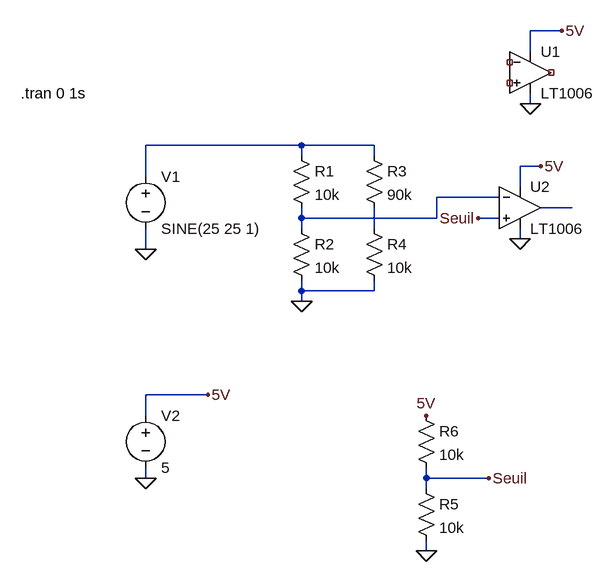
[diagram p0: schematic calibre_courant.asc]
calibre_courant.asc, the LTspice schematic file:
Version 4
SHEET 1 880 680
WIRE 752 -256 704 -256
WIRE 704 -224 704 -256
WIRE 704 -144 704 -160
WIRE 352 -80 112 -80
WIRE 464 -80 352 -80
WIRE 352 -64 352 -80
WIRE 464 -64 464 -80
WIRE 720 -48 688 -48
WIRE 112 -32 112 -80
WIRE 688 -16 688 -48
WIRE 656 0 560 0
WIRE 768 16 720 16
WIRE 352 32 352 16
WIRE 560 32 560 0
WIRE 560 32 352 32
WIRE 656 32 624 32
WIRE 352 48 352 32
WIRE 464 48 464 16
WIRE 688 64 688 48
WIRE 112 80 112 48
WIRE 352 144 352 128
WIRE 464 144 464 128
WIRE 464 144 352 144
WIRE 352 160 352 144
WIRE 208 304 112 304
WIRE 112 336 112 304
WIRE 112 432 112 416
WIRE 544 432 544 416
WIRE 640 432 544 432
WIRE 544 448 544 432
WIRE 544 544 544 528
FLAG 112 80 0
FLAG 352 160 0
FLAG 112 432 0
FLAG 208 304 5V
FLAG 720 -48 5V
FLAG 688 64 0
FLAG 544 544 0
FLAG 544 336 5V
FLAG 640 432 Seuil
FLAG 624 32 Seuil
FLAG 704 -144 0
FLAG 752 -256 5V
SYMBOL voltage 112 -48 R0
SYMATTR InstName V1
SYMATTR Value SINE(25 25 1)
SYMBOL res 336 -80 R0
SYMATTR InstName R1
SYMATTR Value 10k
SYMBOL res 336 32 R0
SYMATTR InstName R2
SYMATTR Value 10k
SYMBOL res 448 -80 R0
SYMATTR InstName R3
SYMATTR Value 90k
SYMBOL res 448 32 R0
SYMATTR InstName R4
SYMATTR Value 10k
SYMBOL voltage 112 320 R0
SYMATTR InstName V2
SYMATTR Value 5
SYMBOL res 528 432 R0
SYMATTR InstName R5
SYMATTR Value 10k
SYMBOL res 528 320 R0
SYMATTR InstName R6
SYMATTR Value 10k
SYMBOL OpAmps/LT1006 688 -48 R0
SYMATTR InstName U2
SYMBOL OpAmps/LT1006 704 -256 R0
SYMATTR InstName U1
TEXT -80 -160 Left 2 !.tran 0 1s

The netlist it stands for:
* calibre_courant.asc
V1 N001 0 SINE(25 25 1)
R1 N001 N002 10k
R2 N002 0 10k
R3 N001 N004 90k
R4 N004 0 10k
V2 5V 0 5
R5 Seuil 0 10k
R6 5V Seuil 10k
XU2 Seuil N002 5V 0 N003 LT1006  ; pins In+ In- V+ V- OUT
XU1 NC_01 NC_02 5V 0 NC_03 LT1006  ; pins In+ In- V+ V- OUT
.tran 0 1s
.lib LTC.lib
.backanno
.end